# EAGLE board panel (EAGLE 6.6.0), part 1 of 2
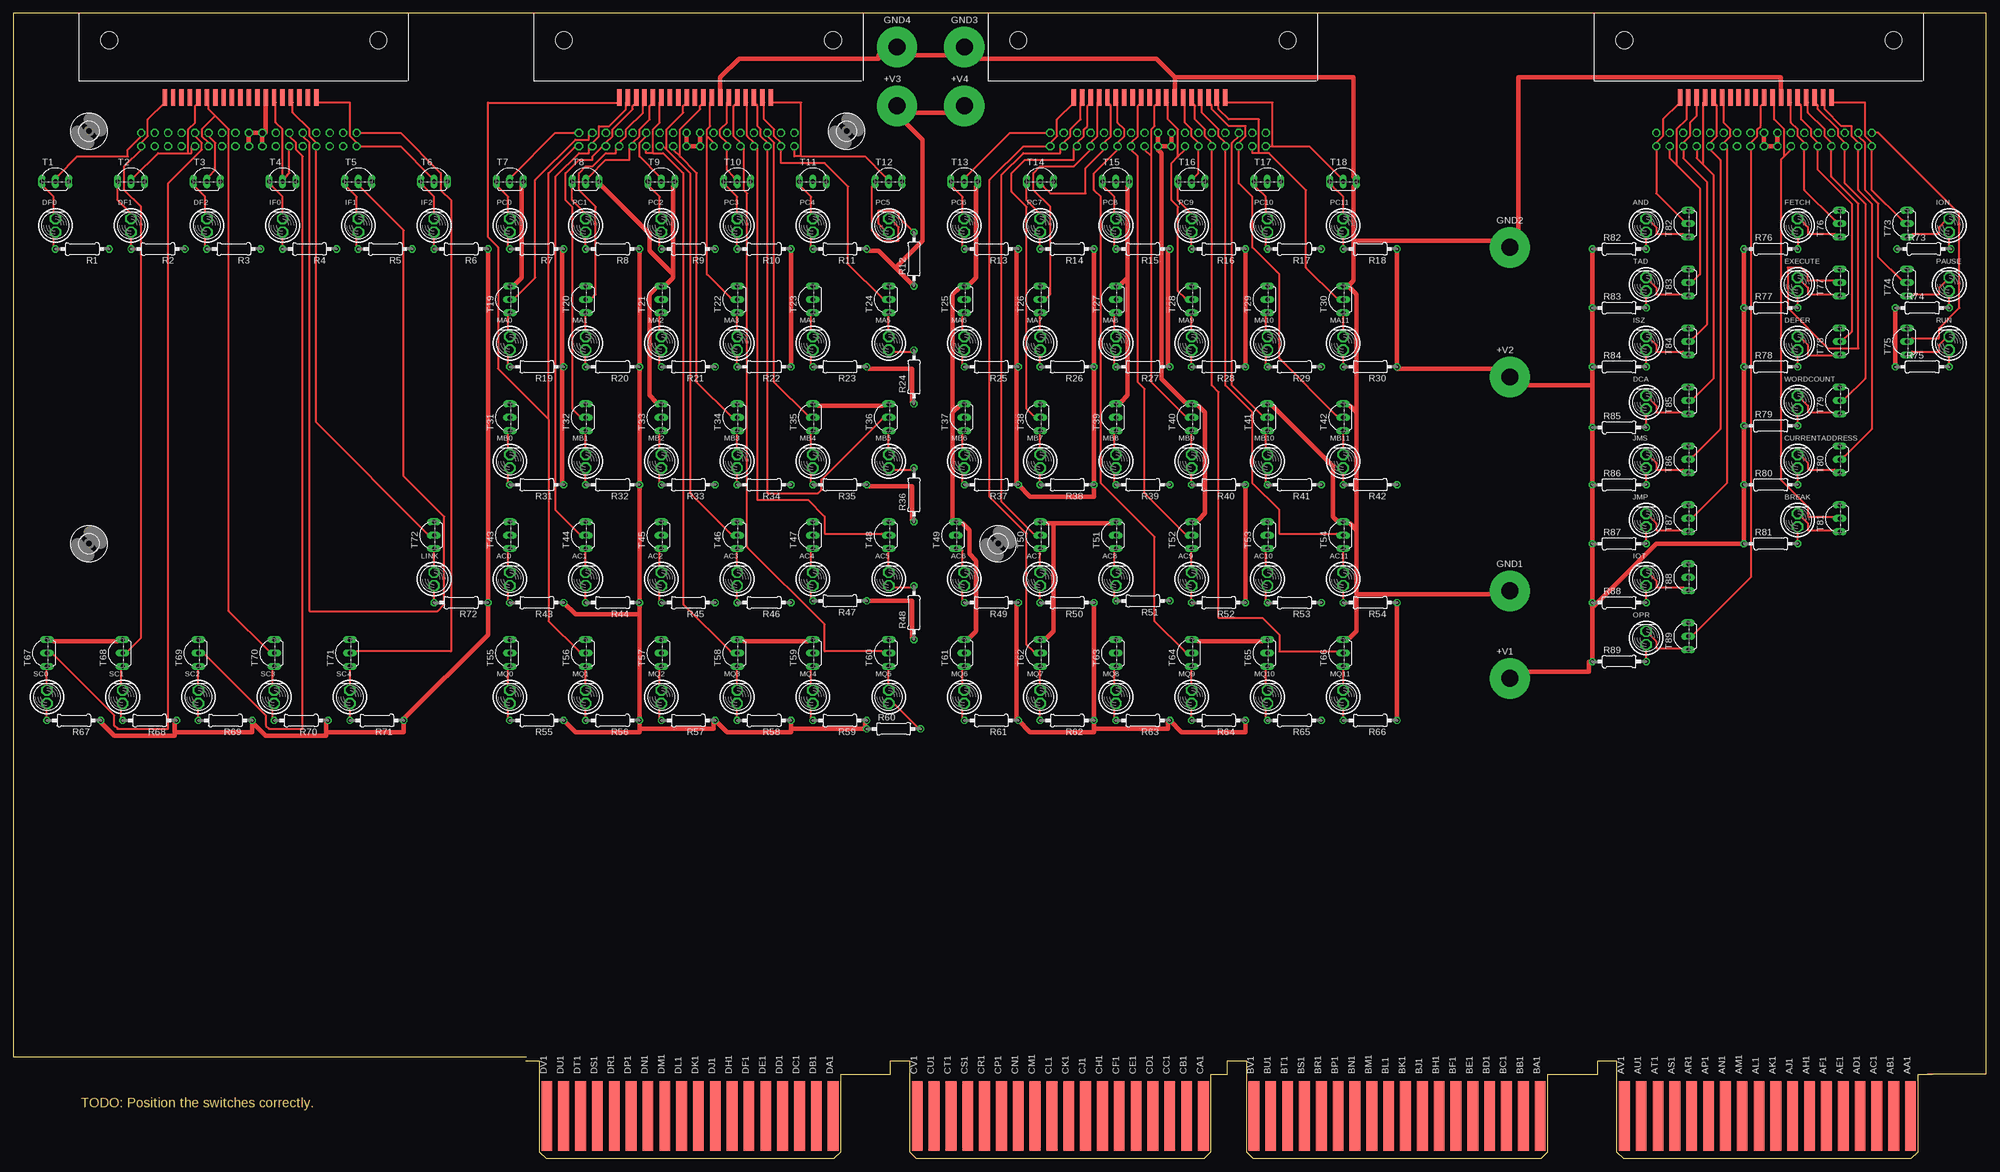
[diagram p2: board, top side]
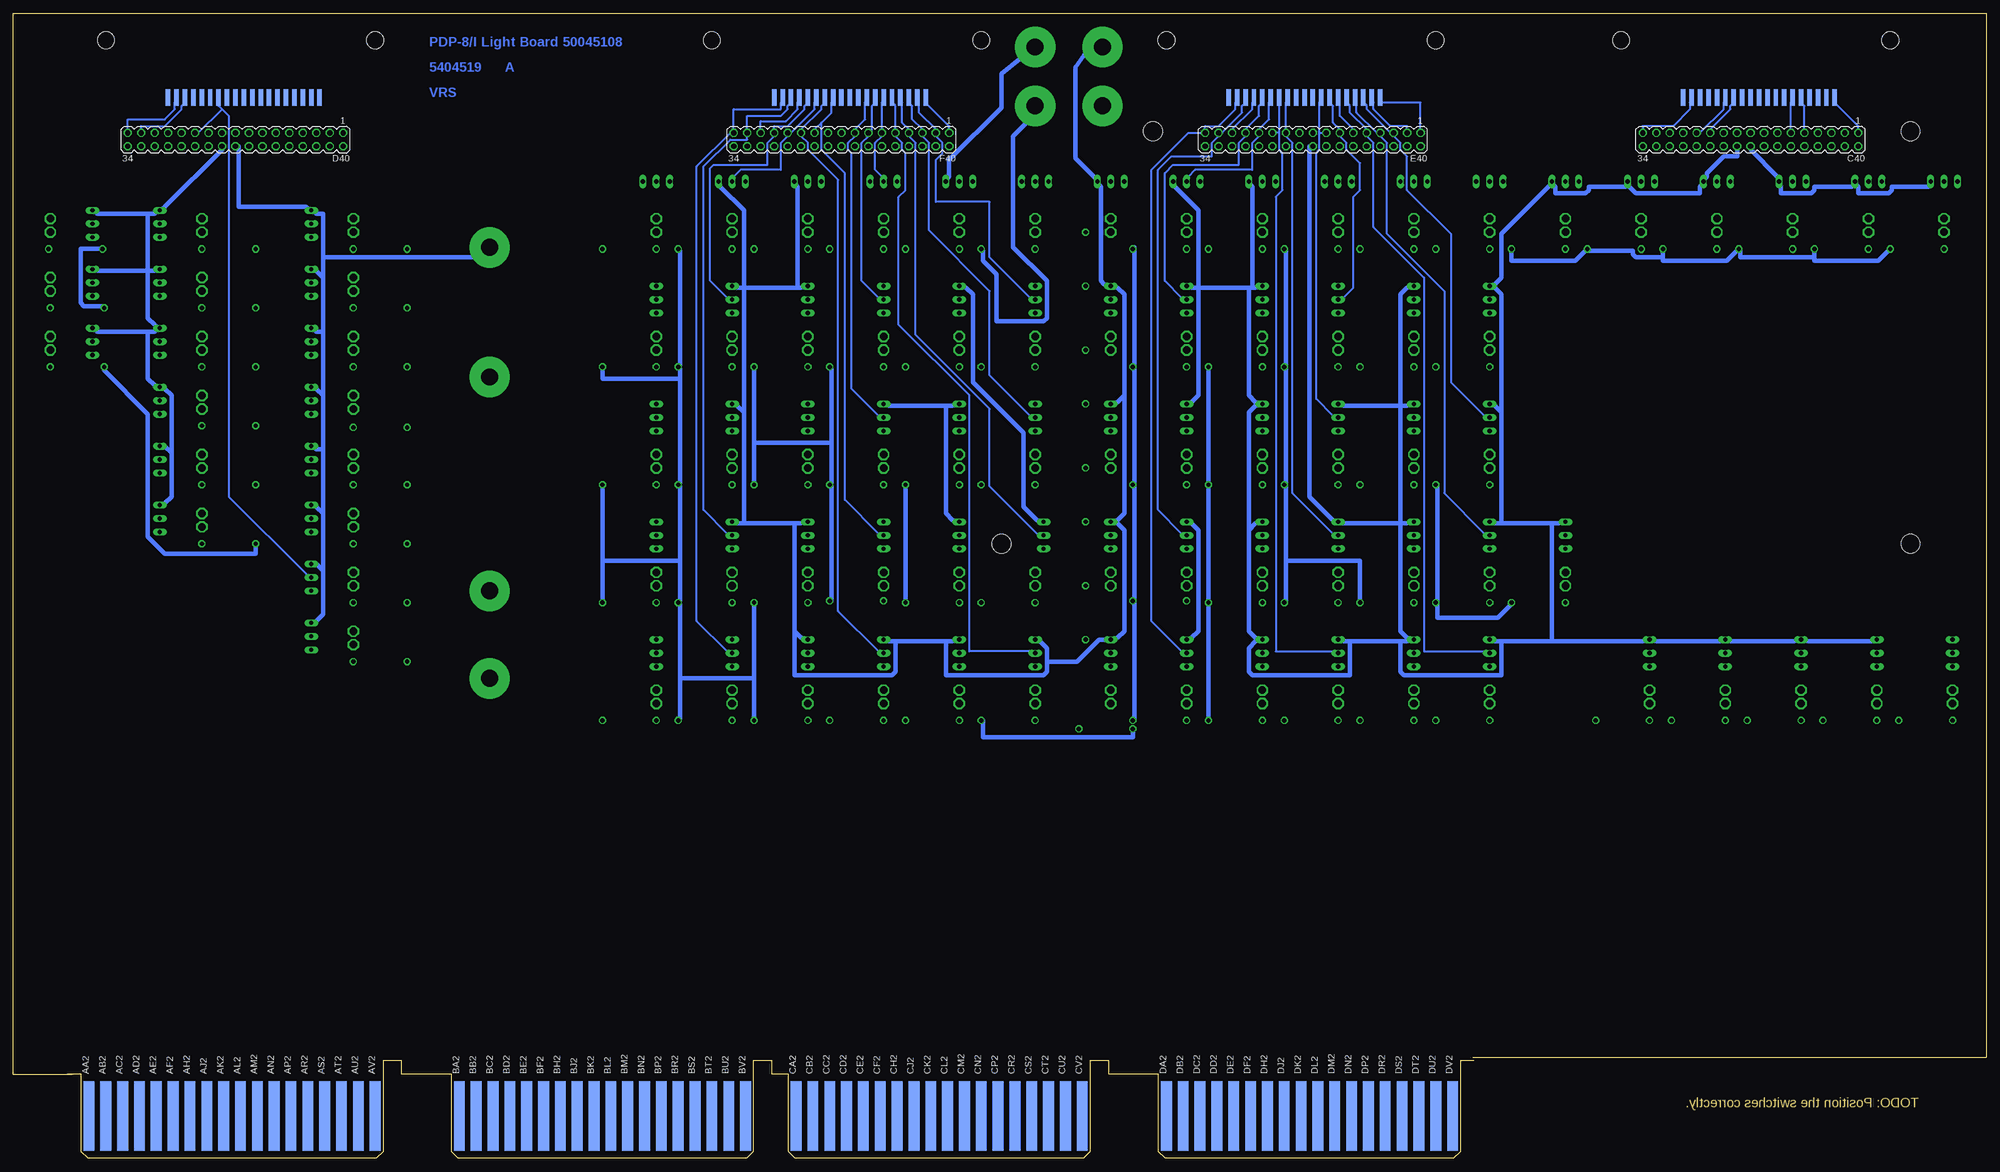
[diagram p3: board, bottom side, seen from below]

Size 372.11 x 215.9 mm. Coordinates in mm from the lower left corner, seen from the top.
Outline: 96.84,19.05 0,19.05 0,215.9 372.11,215.9 372.11,15.88 361,15.88
Copper layers (1+16): Top 0.035mm / dielectric 1.5mm / Bottom 0.035mm
Design rules "16mils": minimum track width 16mil, minimum drill 32mil, track to track 15mil, track to pad 10mil, pad to pad 10mil, via to via 10mil, smd to smd 10mil, copper to edge 13mil, drill to drill 10mil, minimum pad ring 10mil, minimum via ring 8mil, stop-mask expansion 0mil, vias tented up to drill 0mil, thermal gap 10mil
Net classes: 1 supply: width 0.813 mm

## Footprints (pad centres in the part's own frame; a part is rotated, then mirrored left to right if it is on the bottom)
SPADELUG = drill 3.175 pad 7.62: 1 0,0
BULB = drill 1.422 octagon: A 0,0; B 0,2.54
MA17-2 = drill 1.016 octagon: 1 -20.32,-1.27; 2 -20.32,1.27; 3 -17.78,-1.27; 4 -17.78,1.27; 5 -15.24,-1.27; 6 -15.24,1.27; 7 -12.7,-1.27; 8 -12.7,1.27; 9 -10.16,-1.27; 10 -10.16,1.27; 11 -7.62,-1.27; 12 -7.62,1.27; 13 -5.08,-1.27; 14 -5.08,1.27; 15 -2.54,-1.27; 16 -2.54,1.27; 17 0,-1.27; 18 0,1.27; 19 2.54,-1.27; 20 2.54,1.27; 21 5.08,-1.27; 22 5.08,1.27; 23 7.62,-1.27; 24 7.62,1.27; 25 10.16,-1.27; 26 10.16,1.27; 27 12.7,-1.27; 28 12.7,1.27; 29 15.24,-1.27; 30 15.24,1.27; 31 17.78,-1.27; 32 17.78,1.27; 33 20.32,-1.27; 34 20.32,1.27
FLEX19 = smd 3.175 x 0.838: 1 0,14.287; 2 0,12.7; 3 0,11.113; 4 0,9.525; 5 0,7.938; 6 0,6.35; 7 0,4.763; 8 0,3.175; 9 0,1.587; 10 0,0; 11 0,-1.587; 12 0,-3.175; 13 0,-4.763; 14 0,-6.35; 15 0,-7.938; 16 0,-9.525; 17 0,-11.113; 18 0,-12.7; 19 0,-14.287
0207/10 = drill 0.813 octagon: 1 -5.08,0; 2 5.08,0
TO92-CBE = drill 0.813 long: B 0,0; C -2.54,0; E 2.54,0
STRAIN-RELIEF = hole 3.175: 7.62,56.515; 7.62,5.715
3,6 = hole 3.6: 0,0
EDGE-CON8 = smd 2.032 x 13.106: AA1 261.303,7.938; AB1 258.127,7.938; AC1 254.952,7.938; AD1 251.778,7.938; AE1 248.602,7.938; AF1 245.428,7.938; AH1 242.252,7.938; AJ1 239.077,7.938; AK1 235.903,7.938; AL1 232.727,7.938; AM1 229.553,7.938; AN1 226.377,7.938; AP1 223.202,7.938; AR1 220.028,7.938; AS1 216.852,7.938; AT1 213.678,7.938; AU1 210.502,7.938; AV1 207.327,7.938; BA1 191.452,7.938; BB1 188.278,7.938; BC1 185.102,7.938; BD1 181.928,7.938; BE1 178.752,7.938; BF1 175.577,7.938; BH1 172.403,7.938; BJ1 169.227,7.938; BK1 166.053,7.938; BL1 162.877,7.938; BM1 159.702,7.938; BN1 156.528,7.938; BP1 153.352,7.938; BR1 150.178,7.938; BS1 147.002,7.938; BT1 143.827,7.938; BU1 140.653,7.938; BV1 137.477,7.938; CA1 127.953,7.938; CB1 124.778,7.938; CC1 121.603,7.938; CD1 118.427,7.938; CE1 115.252,7.938; CF1 112.078,7.938; CH1 108.903,7.938; CJ1 105.728,7.938; CK1 102.552,7.938; CL1 99.377,7.938; CM1 96.203,7.938; CN1 93.028,7.938; CP1 89.853,7.938; CR1 86.677,7.938; CS1 83.502,7.938; CT1 80.328,7.938; CU1 77.153,7.938; CV1 73.978,7.938; DA1 58.102,7.938; DB1 54.928,7.938; DC1 51.752,7.938; DD1 48.578,7.938; DE1 45.403,7.938; DF1 42.227,7.938; DH1 39.053,7.938; DJ1 35.877,7.938; DK1 32.703,7.938; DL1 29.527,7.938; DM1 26.352,7.938; DN1 23.177,7.938; DP1 20.003,7.938; DR1 16.828,7.938; DS1 13.652,7.938; DT1 10.477,7.938; DU1 7.303,7.938; DV1 4.128,7.938 | smd 2.032 x 13.106 bottom: AA2 261.303,7.938; AB2 258.127,7.938; AC2 254.952,7.938; AD2 251.778,7.938; AE2 248.602,7.938; AF2 245.428,7.938; AH2 242.252,7.938; AJ2 239.077,7.938; AK2 235.903,7.938; AL2 232.727,7.938; AM2 229.553,7.938; AN2 226.377,7.938; AP2 223.202,7.938; AR2 220.028,7.938; AS2 216.852,7.938; AT2 213.678,7.938; AU2 210.502,7.938; AV2 207.327,7.938; BA2 191.452,7.938; BB2 188.278,7.938; BC2 185.102,7.938; BD2 181.928,7.938; BE2 178.752,7.938; BF2 175.577,7.938; BH2 172.403,7.938; BJ2 169.227,7.938; BK2 166.053,7.938; BL2 162.877,7.938; BM2 159.702,7.938; BN2 156.528,7.938; BP2 153.352,7.938; BR2 150.178,7.938; BS2 147.002,7.938; BT2 143.827,7.938; BU2 140.653,7.938; BV2 137.477,7.938; CA2 127.953,7.938; CB2 124.778,7.938; CC2 121.603,7.938; CD2 118.427,7.938; CE2 115.252,7.938; CF2 112.078,7.938; CH2 108.903,7.938; CJ2 105.728,7.938; CK2 102.552,7.938; CL2 99.377,7.938; CM2 96.203,7.938; CN2 93.028,7.938; CP2 89.853,7.938; CR2 86.677,7.938; CS2 83.502,7.938; CT2 80.328,7.938; CU2 77.153,7.938; CV2 73.978,7.938; DA2 58.102,7.938; DB2 54.928,7.938; DC2 51.752,7.938; DD2 48.578,7.938; DE2 45.403,7.938; DF2 42.227,7.938; DH2 39.053,7.938; DJ2 35.877,7.938; DK2 32.703,7.938; DL2 29.527,7.938; DM2 26.352,7.938; DN2 23.177,7.938; DP2 20.003,7.938; DR2 16.828,7.938; DS2 13.652,7.938; DT2 10.477,7.938; DU2 7.303,7.938; DV2 4.128,7.938

## Placement (x,y rotation side)
+V1  LUG  [SPADELUG]  282.26,90.49 0 top
+V2  LUG  [SPADELUG]  282.26,147.32 0 top
+V3  LUG  [SPADELUG]  166.69,198.44 0 top
+V4  LUG  [SPADELUG]  179.39,198.44 0 top
AC0  [BULB]  93.66,107.95 0 top
AC1  [BULB]  107.95,107.95 0 top
AC2  [BULB]  122.24,107.95 0 top
AC3  [BULB]  136.53,107.95 0 top
AC4  [BULB]  150.81,107.95 0 top
AC5  [BULB]  165.1,107.95 0 top
AC6  [BULB]  179.39,107.95 0 top
AC7  [BULB]  193.68,107.95 0 top
AC8  [BULB]  207.96,107.95 0 top
AC9  [BULB]  222.25,107.95 0 top
AC10  [BULB]  236.54,107.95 0 top
AC11  [BULB]  250.82,107.95 0 top
AND  [BULB]  307.98,174.62 0 top
BREAK  [BULB]  336.55,119.06 0 top
C40  [MA17-2]  44.45,192.09 180 bottom
C40BOT  FLEX19  [FLEX19]  42.86,200.03 90 top
C40TOP  FLEX19  [FLEX19]  42.86,200.03 270 bottom
CURRENTADDRESS  [BULB]  336.55,130.18 0 top
D40  [MA17-2]  330.2,192.09 180 bottom
D40BOT  FLEX19  [FLEX19]  128.59,200.03 90 top
D40TOP  FLEX19  [FLEX19]  128.59,200.03 270 bottom
DCA  [BULB]  307.98,141.29 0 top
DEFER  [BULB]  336.55,152.4 0 top
DF0  [BULB]  7.94,174.62 0 top
DF1  [BULB]  22.23,174.62 0 top
DF2  [BULB]  36.51,174.62 0 top
E40  [MA17-2]  127,192.09 180 bottom
E40BOT  FLEX19  [FLEX19]  214.31,200.03 90 top
E40TOP  FLEX19  [FLEX19]  214.31,200.03 270 bottom
EXECUTE  [BULB]  336.55,163.51 0 top
F40  [MA17-2]  215.9,192.09 180 bottom
F40BOT  FLEX19  [FLEX19]  328.61,200.03 90 top
F40TOP  FLEX19  [FLEX19]  328.61,200.03 270 bottom
FETCH  [BULB]  336.55,174.62 0 top
GND1  LUG  [SPADELUG]  282.26,107 0 top
GND2  LUG  [SPADELUG]  282.26,171.77 0 top
GND3  LUG  [SPADELUG]  179.39,209.55 0 top
GND4  LUG  [SPADELUG]  166.69,209.55 0 top
IF0  [BULB]  50.8,174.62 0 top
IF1  [BULB]  65.09,174.62 0 top
IF2  [BULB]  79.38,174.62 0 top
ION  [BULB]  365.12,174.62 0 top
IOT  [BULB]  307.98,107.95 0 top
ISZ  [BULB]  307.98,152.4 0 top
JMP  [BULB]  307.98,119.06 0 top
JMS  [BULB]  307.98,130.18 0 top
LINK  [BULB]  79.38,107.95 0 top
MA0  [BULB]  93.66,152.4 0 top
MA1  [BULB]  107.95,152.4 0 top
MA2  [BULB]  122.24,152.4 0 top
MA3  [BULB]  136.53,152.4 0 top
MA4  [BULB]  150.81,152.4 0 top
MA5  [BULB]  165.1,152.4 0 top
MA6  [BULB]  179.39,152.4 0 top
MA7  [BULB]  193.68,152.4 0 top
MA8  [BULB]  207.96,152.4 0 top
MA9  [BULB]  222.25,152.4 0 top
MA10  [BULB]  236.54,152.4 0 top
MA11  [BULB]  250.82,152.4 0 top
MB0  [BULB]  93.66,130.18 0 top
MB1  [BULB]  107.95,130.18 0 top
MB2  [BULB]  122.24,130.18 0 top
MB3  [BULB]  136.53,130.18 0 top
MB4  [BULB]  150.81,130.18 0 top
MB5  [BULB]  165.1,130.18 0 top
MB6  [BULB]  179.39,130.18 0 top
MB7  [BULB]  193.68,130.18 0 top
MB8  [BULB]  207.96,130.18 0 top
MB9  [BULB]  222.25,130.18 0 top
MB10  [BULB]  236.54,130.18 0 top
MB11  [BULB]  250.82,130.18 0 top
MQ0  [BULB]  93.66,85.72 0 top
MQ1  [BULB]  107.95,85.72 0 top
MQ2  [BULB]  122.24,85.72 0 top
MQ3  [BULB]  136.53,85.72 0 top
MQ4  [BULB]  150.81,85.72 0 top
MQ5  [BULB]  165.1,85.72 0 top
MQ6  [BULB]  179.39,85.72 0 top
MQ7  [BULB]  193.68,85.72 0 top
MQ8  [BULB]  207.96,85.72 0 top
MQ9  [BULB]  222.25,85.72 0 top
MQ10  [BULB]  236.54,85.72 0 top
MQ11  [BULB]  250.82,85.72 0 top
OPR  [BULB]  307.98,96.84 0 top
PAUSE  [BULB]  365.12,163.51 0 top
PC0  [BULB]  93.66,174.62 0 top
PC1  [BULB]  107.95,174.62 0 top
PC2  [BULB]  122.24,174.62 0 top
PC3  [BULB]  136.53,174.62 0 top
PC4  [BULB]  150.81,174.62 0 top
PC5  [BULB]  165.1,174.62 0 top
PC6  [BULB]  179.39,174.62 0 top
PC7  [BULB]  193.68,174.62 0 top
PC8  [BULB]  207.96,174.62 0 top
PC9  [BULB]  222.25,174.62 0 top
PC10  [BULB]  236.54,174.62 0 top
PC11  [BULB]  250.82,174.62 0 top
R1  1.5K  [0207/10]  13.02,171.45 180 top
R2  1.5K  [0207/10]  27.3,171.45 180 top
R3  1.5K  [0207/10]  41.59,171.45 180 top
R4  1.5K  [0207/10]  55.88,171.45 180 top
R5  1.5K  [0207/10]  70.17,171.45 180 top
R6  1.5K  [0207/10]  84.45,171.45 180 top
R7  1.5K  [0207/10]  98.74,171.45 180 top
R8  1.5K  [0207/10]  113.03,171.45 180 top
R9  1.5K  [0207/10]  127.32,171.45 180 top
R10  1.5K  [0207/10]  141.6,171.45 180 top
R11  1.5K  [0207/10]  155.89,171.45 180 top
R12  1.5K  [0207/10]  169.86,169.54 90 top
R13  1.5K  [0207/10]  184.47,171.45 180 top
R14  1.5K  [0207/10]  198.75,171.45 180 top
R15  1.5K  [0207/10]  213.04,171.45 180 top
R16  1.5K  [0207/10]  227.33,171.45 180 top
R17  1.5K  [0207/10]  241.62,171.45 180 top
R18  1.5K  [0207/10]  255.91,171.45 180 top
R19  1.5K  [0207/10]  98.74,149.22 180 top
R20  1.5K  [0207/10]  113.03,149.22 180 top
R21  1.5K  [0207/10]  127.32,149.22 180 top
R22  1.5K  [0207/10]  141.6,149.22 180 top
R23  1.5K  [0207/10]  155.89,149.22 180 top
R24  1.5K  [0207/10]  169.86,147.32 90 top
R25  1.5K  [0207/10]  184.47,149.22 180 top
R26  1.5K  [0207/10]  198.75,149.22 180 top
R27  1.5K  [0207/10]  213.04,149.22 180 top
R28  1.5K  [0207/10]  227.33,149.22 180 top
R29  1.5K  [0207/10]  241.62,149.22 180 top
R30  1.5K  [0207/10]  255.91,149.22 180 top
R31  1.5K  [0207/10]  98.74,127 180 top
R32  1.5K  [0207/10]  113.03,127 180 top
R33  1.5K  [0207/10]  127.32,127 180 top
R34  1.5K  [0207/10]  141.6,127 180 top
R35  1.5K  [0207/10]  155.89,127 180 top
R36  1.5K  [0207/10]  169.86,125.09 90 top
R37  1.5K  [0207/10]  184.47,127 180 top
R38  1.5K  [0207/10]  198.75,127 180 top
R39  1.5K  [0207/10]  213.04,127 180 top
R40  1.5K  [0207/10]  227.33,127 180 top
R41  1.5K  [0207/10]  241.62,127 180 top
R42  1.5K  [0207/10]  255.91,127 180 top
R43  1.5K  [0207/10]  98.74,104.78 180 top
R44  1.5K  [0207/10]  113.03,104.78 180 top
R45  1.5K  [0207/10]  127.32,104.78 180 top
R46  1.5K  [0207/10]  141.6,104.78 180 top
R47  1.5K  [0207/10]  155.89,105.09 180 top
R48  1.5K  [0207/10]  169.86,102.87 90 top
R49  1.5K  [0207/10]  184.47,104.78 180 top
R50  1.5K  [0207/10]  198.75,104.78 180 top
R51  1.5K  [0207/10]  213.04,105.09 180 top
R52  1.5K  [0207/10]  227.33,104.78 180 top
R53  1.5K  [0207/10]  241.62,104.78 180 top
R54  1.5K  [0207/10]  255.91,104.78 180 top
R55  1.5K  [0207/10]  98.74,82.55 180 top
R56  1.5K  [0207/10]  113.03,82.55 180 top
R57  1.5K  [0207/10]  127.32,82.55 180 top
R58  1.5K  [0207/10]  141.6,82.55 180 top
R59  1.5K  [0207/10]  155.89,82.55 180 top
R60  1.5K  [0207/10]  166.05,80.96 0 top
R61  1.5K  [0207/10]  184.47,82.55 180 top
R62  1.5K  [0207/10]  198.75,82.55 180 top
R63  1.5K  [0207/10]  213.04,82.55 180 top
R64  1.5K  [0207/10]  227.33,82.55 180 top
R65  1.5K  [0207/10]  241.62,82.55 180 top
R66  1.5K  [0207/10]  255.91,82.55 180 top
R67  1.5K  [0207/10]  11.43,82.55 180 top
R68  1.5K  [0207/10]  25.72,82.55 180 top
R69  1.5K  [0207/10]  40.01,82.55 180 top
R70  1.5K  [0207/10]  54.29,82.55 180 top
R71  1.5K  [0207/10]  68.58,82.55 180 top
R72  1.5K  [0207/10]  84.45,104.78 180 top
R73  1.5K  [0207/10]  360.36,171.45 0 top
R74  1.5K  [0207/10]  360.05,160.34 0 top
R75  1.5K  [0207/10]  360.05,149.22 0 top
R76  1.5K  [0207/10]  331.47,171.45 0 top
R77  1.5K  [0207/10]  331.47,160.34 0 top
R78  1.5K  [0207/10]  331.47,149.22 0 top
R79  1.5K  [0207/10]  331.47,138.11 0 top
R80  1.5K  [0207/10]  331.47,127 0 top
R81  1.5K  [0207/10]  331.47,115.89 0 top
R82  1.5K  [0207/10]  302.89,171.45 0 top
R83  1.5K  [0207/10]  302.89,160.34 0 top
R84  1.5K  [0207/10]  302.89,149.22 0 top
R85  1.5K  [0207/10]  302.89,137.79 0 top
R86  1.5K  [0207/10]  302.89,127 0 top
R87  1.5K  [0207/10]  302.89,115.89 0 top
R88  1.5K  [0207/10]  302.89,104.78 0 top
R89  1.5K  [0207/10]  302.89,93.66 0 top
RUN  [BULB]  365.12,152.4 0 top
SC0  [BULB]  6.35,85.72 0 top
SC1  [BULB]  20.64,85.72 0 top
SC2  [BULB]  34.92,85.72 0 top
SC3  [BULB]  49.21,85.72 0 top
SC4  [BULB]  63.5,85.72 0 top
T1  [TO92-CBE]  7.94,184.15 0 top
T2  [TO92-CBE]  22.23,184.15 0 top
T3  [TO92-CBE]  36.51,184.15 0 top
T4  [TO92-CBE]  50.8,184.15 0 top
T5  [TO92-CBE]  65.09,184.15 0 top
T6  [TO92-CBE]  79.38,184.15 0 top
T7  [TO92-CBE]  93.66,184.15 0 top
T8  [TO92-CBE]  107.95,184.15 0 top
T9  [TO92-CBE]  122.24,184.15 0 top
T10  [TO92-CBE]  136.53,184.15 0 top
T11  [TO92-CBE]  150.81,184.15 0 top
T12  [TO92-CBE]  165.1,184.15 0 top
T13  [TO92-CBE]  179.39,184.15 0 top
T14  [TO92-CBE]  193.68,184.15 0 top
T15  [TO92-CBE]  207.96,184.15 0 top
T16  [TO92-CBE]  222.25,184.15 0 top
T17  [TO92-CBE]  236.54,184.15 0 top
T18  [TO92-CBE]  250.82,184.15 0 top
T19  [TO92-CBE]  93.66,161.93 90 top
T20  [TO92-CBE]  107.95,161.93 90 top
T21  [TO92-CBE]  122.24,161.93 90 top
T22  [TO92-CBE]  136.53,161.93 90 top
T23  [TO92-CBE]  150.81,161.93 90 top
T24  [TO92-CBE]  165.1,161.93 90 top
T25  [TO92-CBE]  179.39,161.93 90 top
T26  [TO92-CBE]  193.68,161.93 90 top
T27  [TO92-CBE]  207.96,161.93 90 top
T28  [TO92-CBE]  222.25,161.93 90 top
T29  [TO92-CBE]  236.54,161.93 90 top
T30  [TO92-CBE]  250.82,161.93 90 top
T31  [TO92-CBE]  93.66,139.7 90 top
T32  [TO92-CBE]  107.95,139.7 90 top
T33  [TO92-CBE]  122.24,139.7 90 top
T34  [TO92-CBE]  136.53,139.7 90 top
T35  [TO92-CBE]  150.81,139.7 90 top
T36  [TO92-CBE]  165.1,139.7 90 top
T37  [TO92-CBE]  179.39,139.7 90 top
T38  [TO92-CBE]  193.68,139.7 90 top
T39  [TO92-CBE]  207.96,139.7 90 top
T40  [TO92-CBE]  222.25,139.7 90 top
T41  [TO92-CBE]  236.54,139.7 90 top
T42  [TO92-CBE]  250.82,139.7 90 top
T43  [TO92-CBE]  93.66,117.47 90 top
T44  [TO92-CBE]  107.95,117.47 90 top
T45  [TO92-CBE]  122.24,117.47 90 top
T46  [TO92-CBE]  136.53,117.47 90 top
T47  [TO92-CBE]  150.81,117.47 90 top
T48  [TO92-CBE]  165.1,117.47 90 top
T49  [TO92-CBE]  177.8,117.47 90 top
T50  [TO92-CBE]  193.68,117.47 90 top
T51  [TO92-CBE]  207.96,117.47 90 top
T52  [TO92-CBE]  222.25,117.47 90 top
T53  [TO92-CBE]  236.54,117.47 90 top
T54  [TO92-CBE]  250.82,117.47 90 top
T55  [TO92-CBE]  93.66,95.25 90 top
T56  [TO92-CBE]  107.95,95.25 90 top
T57  [TO92-CBE]  122.24,95.25 90 top
T58  [TO92-CBE]  136.53,95.25 90 top
T59  [TO92-CBE]  150.81,95.25 90 top
T60  [TO92-CBE]  165.1,95.25 90 top
T61  [TO92-CBE]  179.39,95.25 90 top
T62  [TO92-CBE]  193.68,95.25 90 top
T63  [TO92-CBE]  207.96,95.25 90 top
T64  [TO92-CBE]  222.25,95.25 90 top
T65  [TO92-CBE]  236.54,95.25 90 top
T66  [TO92-CBE]  250.82,95.25 90 top
T67  [TO92-CBE]  6.35,95.25 90 top
T68  [TO92-CBE]  20.64,95.25 90 top
T69  [TO92-CBE]  34.92,95.25 90 top
T70  [TO92-CBE]  49.21,95.25 90 top
T71  [TO92-CBE]  63.5,95.25 90 top
T72  [TO92-CBE]  79.38,117.47 90 top
T73  [TO92-CBE]  357.19,176.21 90 top
T74  [TO92-CBE]  357.19,165.1 90 top
T75  [TO92-CBE]  357.19,153.99 90 top
T76  [TO92-CBE]  344.49,176.21 90 top
T77  [TO92-CBE]  344.49,165.1 90 top
T78  [TO92-CBE]  344.49,153.99 90 top
T79  [TO92-CBE]  344.49,142.88 90 top
T80  [TO92-CBE]  344.49,131.76 90 top
T81  [TO92-CBE]  344.49,120.65 90 top
T82  [TO92-CBE]  315.91,176.21 90 top
T83  [TO92-CBE]  315.91,165.1 90 top
T84  [TO92-CBE]  315.91,153.99 90 top
T85  [TO92-CBE]  315.91,142.88 90 top
T86  [TO92-CBE]  315.91,131.76 90 top
T87  [TO92-CBE]  315.91,120.65 90 top
T88  [TO92-CBE]  315.91,109.54 90 top
T89  [TO92-CBE]  315.91,98.42 90 top
TAD  [BULB]  307.98,163.51 0 top
U$1  [STRAIN-RELIEF]  74.61,203.2 90 top
U$2  [STRAIN-RELIEF]  160.34,203.2 90 top
U$3  [STRAIN-RELIEF]  246.06,203.2 90 top
U$4  [STRAIN-RELIEF]  360.36,203.2 90 top
U$7  [3,6]  185.74,115.89 0 top
U$8  [3,6]  14.29,115.89 0 top
U$9  [3,6]  14.29,193.68 0 top
U$10  [EDGE-CON8]  96.52,0 0 top
U$11  [3,6]  157.16,193.68 0 top
WORDCOUNT  [BULB]  336.55,141.29 0 top